# EAGLE schematic untitled2 (EAGLE 8.2.0)
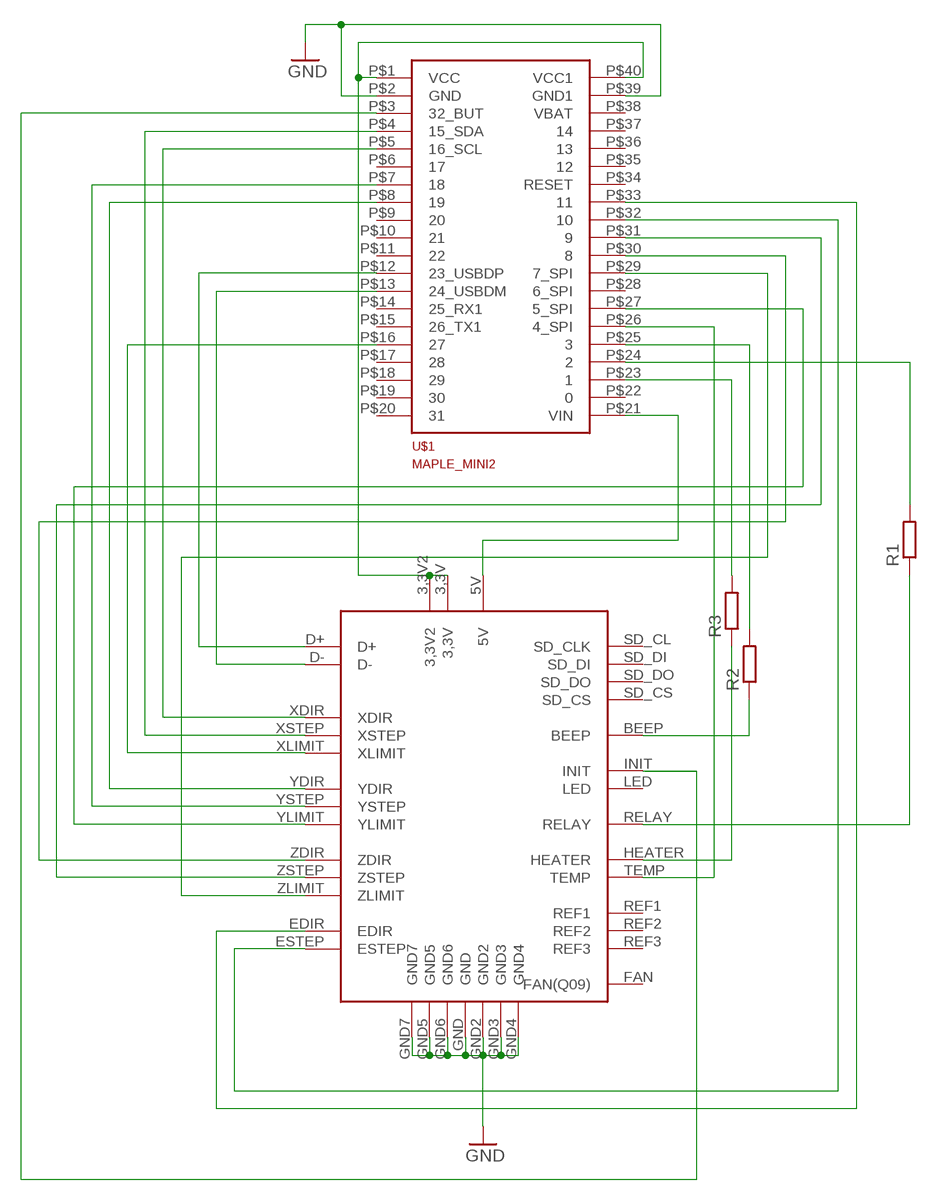
[diagram p0: schematic, sheet 1]

## Parts
R1  R-EU_0204/7  [0204/7]
R2  R-EU_0204/7  [0204/7]
R3  R-EU_0204/7  [0204/7]
U$1  MAPLE_MINI2  [MAPLE_MINI]
U$2  CETUS_CONTROLLER  [CETUS_CONTROLLER]

## Nets
3,3V: U$1.P$1(VCC) U$1.P$40(VCC1) U$2.3,3V U$2.3,3V2
5V: U$1.P$21(VIN) U$2.5V
GND: U$1.P$2(GND) U$1.P$39(GND1) U$2.GND U$2.GND2 U$2.GND3 U$2.GND4 U$2.GND5 U$2.GND6 U$2.GND7
N$1: U$1.P$12(23_USBDP) U$2.D+
N$2: U$1.P$13(24_USBDM) U$2.D-
N$3: U$1.P$4(15_SDA) U$2.XSTEP
N$4: U$1.P$5(16_SCL) U$2.XDIR
N$5: U$1.P$16 U$2.XLIMIT
N$6: U$1.P$7 U$2.YSTEP
N$7: U$1.P$8 U$2.YDIR
N$8: U$1.P$27(5_SPI) U$2.YLIMIT
N$9: U$1.P$31 U$2.ZSTEP
N$10: U$1.P$30 U$2.ZDIR
N$11: U$1.P$29(7_SPI) U$2.ZLIMIT
N$12: U$1.P$32 U$2.ESTEP
N$13: U$1.P$33 U$2.EDIR
N$14: R2.2 U$1.P$25
N$15: R3.2 U$1.P$23
N$16: U$1.P$26(4_SPI) U$2.TEMP
N$19: U$1.P$3(32_BUT) U$2.INIT
N$20: R1.1 U$2.RELAY
N$21: R1.2 U$1.P$24
N$22: R2.1 U$2.BEEP
N$23: R3.1 U$2.HEATER
Unconnected: U$1.P$6 U$1.P$9 U$1.P$10 U$1.P$11 U$1.P$14(25_RX1) U$1.P$15(26_TX1) U$1.P$17 U$1.P$18 U$1.P$19 U$1.P$20 U$1.P$22 U$1.P$28(6_SPI) U$1.P$34(RESET) U$1.P$35 U$1.P$36 U$1.P$37 U$1.P$38(VBAT) U$2.FAN(FAN(Q09)) U$2.LED U$2.REF1 U$2.REF2 U$2.REF3 U$2.SD_CL(SD_CLK) U$2.SD_CS U$2.SD_DI U$2.SD_DO

## Library data of the parts
R1-R3 = resistor:R-EU_: RESISTOR, European symbol
U$1 = maple_mini:MAPLE_MINI2
U$2 = cetus:CETUS_CONTROLLER